# EAGLE design M633X (EAGLE 6.6.0)
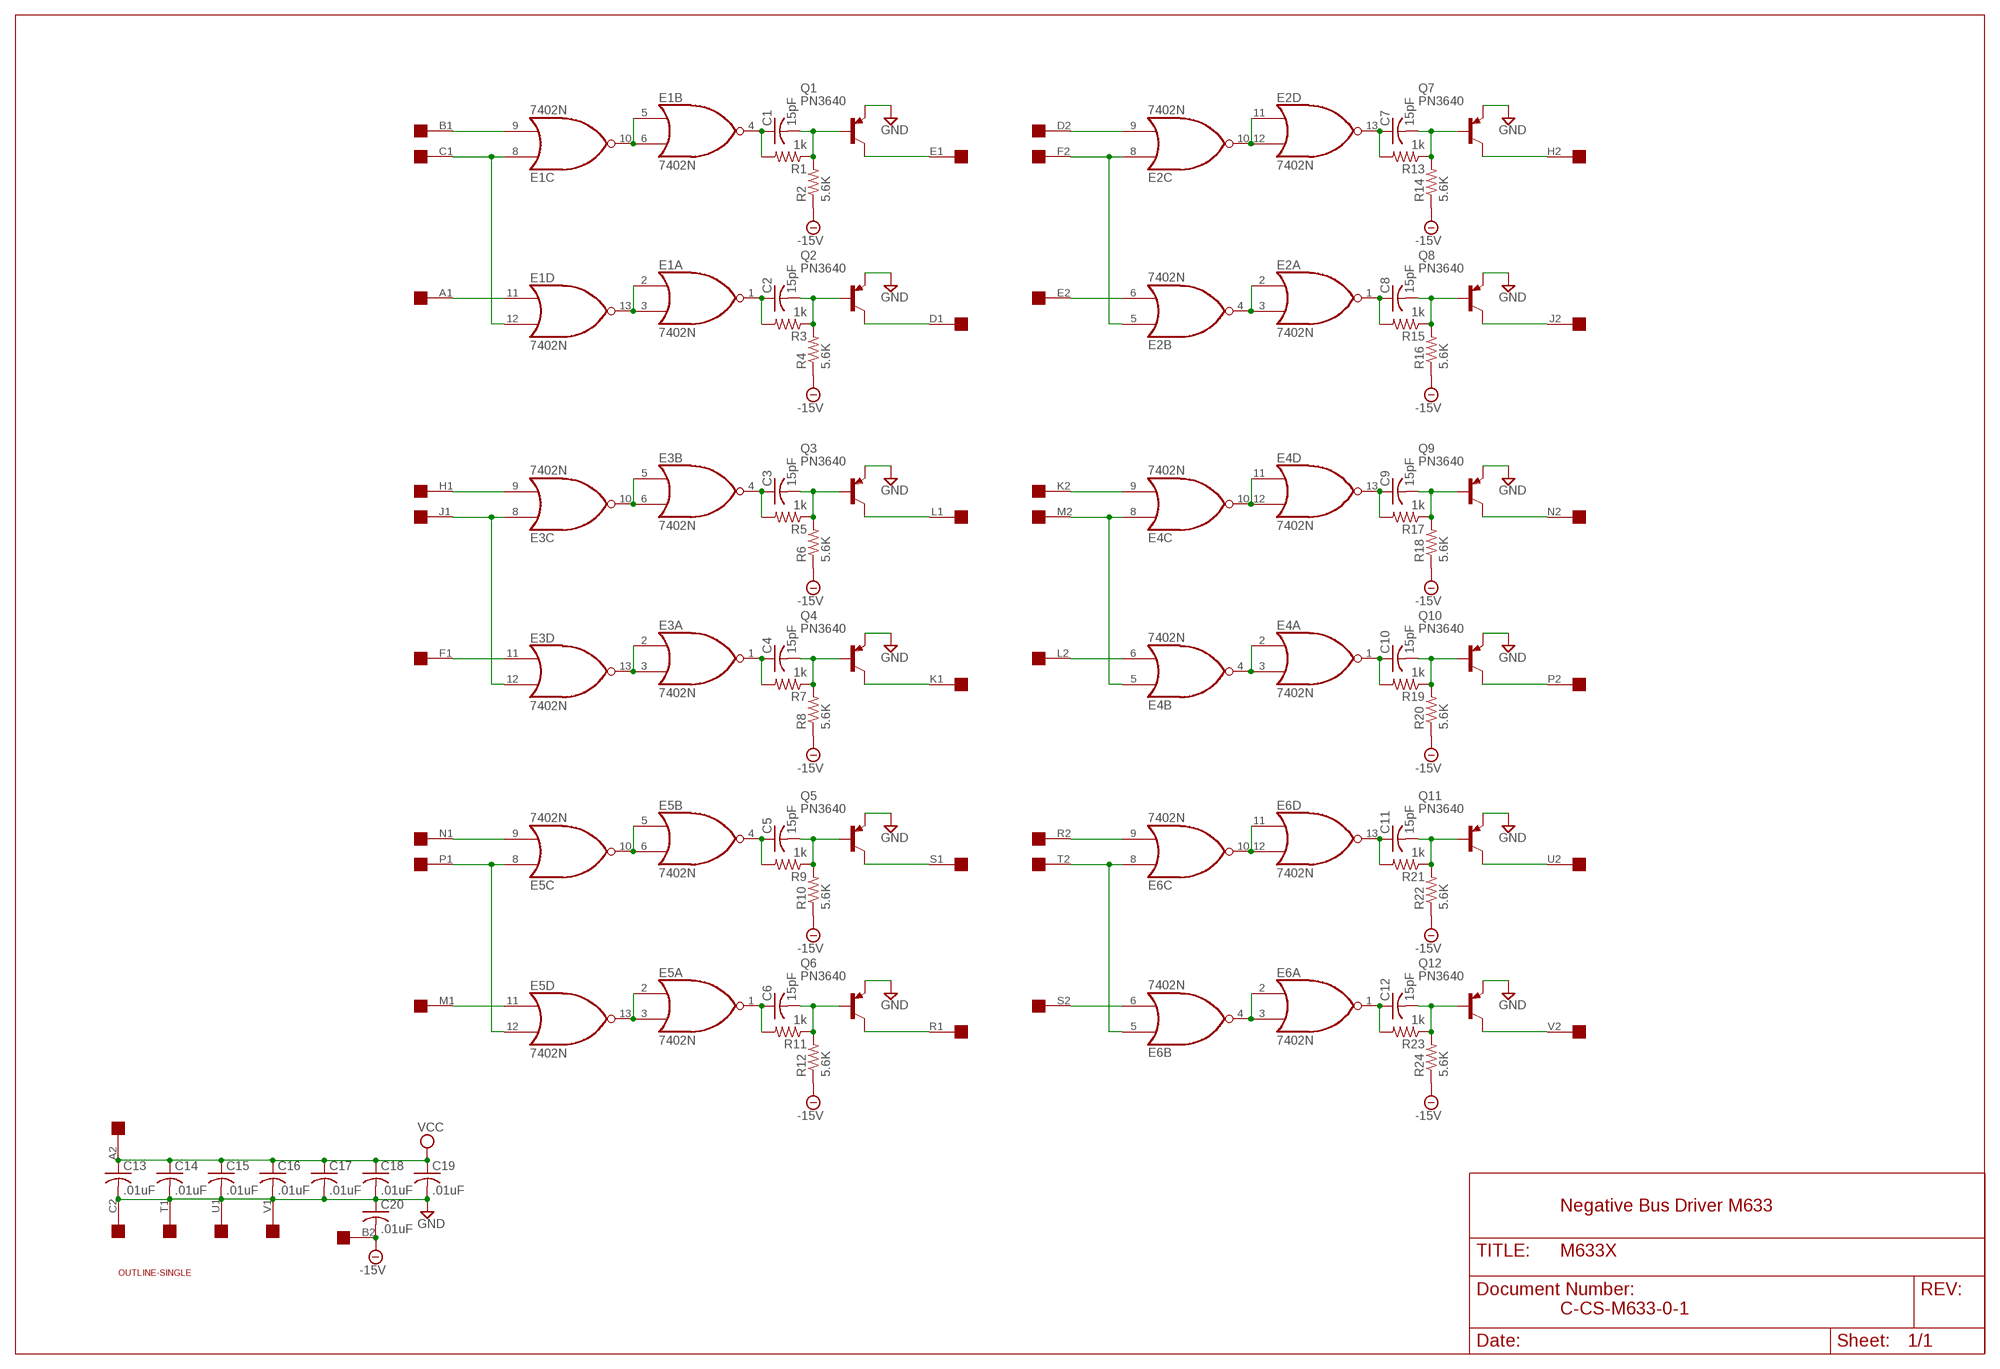
[diagram p0: schematic, sheet 1]

## Parts
C1  15pF  C-US050-025X075  [C050-025X075]
C2  15pF  C-US050-025X075  [C050-025X075]
C3  15pF  C-US050-025X075  [C050-025X075]
C4  15pF  C-US050-025X075  [C050-025X075]
C5  15pF  C-US050-025X075  [C050-025X075]
C6  15pF  C-US050-025X075  [C050-025X075]
C7  15pF  C-US050-025X075  [C050-025X075]
C8  15pF  C-US050-025X075  [C050-025X075]
C9  15pF  C-US050-025X075  [C050-025X075]
C10  15pF  C-US050-025X075  [C050-025X075]
C11  15pF  C-US050-025X075  [C050-025X075]
C12  15pF  C-US050-025X075  [C050-025X075]
C13  .01uF  C-US050-025X075  [C050-025X075]
C14  .01uF  C-US050-025X075  [C050-025X075]
C15  .01uF  C-US050-025X075  [C050-025X075]
C16  .01uF  C-US050-025X075  [C050-025X075]
C17  .01uF  C-US050-025X075  [C050-025X075]
C18  .01uF  C-US050-025X075  [C050-025X075]
C19  .01uF  C-US050-025X075  [C050-025X075]
C20  .01uF  C-US050-025X075  [C050-025X075]
E1  7402N  [DIL14]
E2  7402N  [DIL14]
E3  7402N  [DIL14]
E4  7402N  [DIL14]
E5  7402N  [DIL14]
E6  7402N  [DIL14]
Q1  PN3640  2N5415  [TO39]
Q2  PN3640  2N5415  [TO39]
Q3  PN3640  2N5415  [TO39]
Q4  PN3640  2N5415  [TO39]
Q5  PN3640  2N5415  [TO39]
Q6  PN3640  2N5415  [TO39]
Q7  PN3640  2N5415  [TO39]
Q8  PN3640  2N5415  [TO39]
Q9  PN3640  2N5415  [TO39]
Q10  PN3640  2N5415  [TO39]
Q11  PN3640  2N5415  [TO39]
Q12  PN3640  2N5415  [TO39]
R1  1k  R-US_0207/10  [0207/10]
R2  5.6K  R-US_0207/10  [0207/10]
R3  1k  R-US_0207/10  [0207/10]
R4  5.6K  R-US_0207/10  [0207/10]
R5  1k  R-US_0207/10  [0207/10]
R6  5.6K  R-US_0207/10  [0207/10]
R7  1k  R-US_0207/10  [0207/10]
R8  5.6K  R-US_0207/10  [0207/10]
R9  1k  R-US_0207/10  [0207/10]
R10  5.6K  R-US_0207/10  [0207/10]
R11  1k  R-US_0207/10  [0207/10]
R12  5.6K  R-US_0207/10  [0207/10]
R13  1k  R-US_0207/10  [0207/10]
R14  5.6K  R-US_0207/10  [0207/10]
R15  1k  R-US_0207/10  [0207/10]
R16  5.6K  R-US_0207/10  [0207/10]
R17  1k  R-US_0207/10  [0207/10]
R18  5.6K  R-US_0207/10  [0207/10]
R19  1k  R-US_0207/10  [0207/10]
R20  5.6K  R-US_0207/10  [0207/10]
R21  1k  R-US_0207/10  [0207/10]
R22  5.6K  R-US_0207/10  [0207/10]
R23  1k  R-US_0207/10  [0207/10]
R24  5.6K  R-US_0207/10  [0207/10]
U$1  OUTLINE-SINGLE  [SINGLE]
U$4  SINGLE  [EDGE-CON2]

## Nets
-15V: C20.2 R2.1 R4.1 R6.1 R8.1 R10.1 R12.1 R14.1 R16.1 R18.1 R20.1 R22.1 R24.1 U$4.B2
GND [Supply]: C13.2 C14.2 C15.2 C16.2 C17.2 C18.2 C19.2 C20.1 Q1.1(E) Q2.1(E) Q3.1(E) Q4.1(E) Q5.1(E) Q6.1(E) Q7.1(E) Q8.1(E) Q9.1(E) Q10.1(E) Q11.1(E) Q12.1(E) U$4.C2 U$4.T1 U$4.U1 U$4.V1
N$1: E1.5(B:I0) E1.6(B:I1) E1.10(C:O)
N$2: C1.1 E1.4(B:O) R1.2
N$3: C1.2 Q1.2(B) R1.1 R2.2
N$4: E1.2(A:I0) E1.3(A:I1) E1.13(D:O)
N$5: E4.10(C:O) E4.11(D:I0) E4.12(D:I1)
N$6: C9.1 E4.13(D:O) R17.2
N$7: E4.2(A:I0) E4.3(A:I1) E4.4(B:O)
N$8: C10.1 E4.1(A:O) R19.2
N$9: C10.2 Q10.2(B) R19.1 R20.2
N$10: E4.5(B:I0) E4.8(C:I0) U$4.M2
N$11: E4.9(C:I1) U$4.K2
N$12: C2.1 E1.1(A:O) R3.2
N$13: C2.2 Q2.2(B) R3.1 R4.2
N$14: E1.8(C:I0) E1.12(D:I1) U$4.C1
N$15: E1.9(C:I1) U$4.B1
N$16: E1.11(D:I0) U$4.A1
N$17: Q2.3(C) U$4.D1
N$18: Q1.3(C) U$4.E1
N$19: E2.10(C:O) E2.11(D:I0) E2.12(D:I1)
N$20: C7.1 E2.13(D:O) R13.2
N$21: C7.2 Q7.2(B) R13.1 R14.2
N$22: E2.2(A:I0) E2.3(A:I1) E2.4(B:O)
N$23: E4.6(B:I1) U$4.L2
N$24: C8.1 E2.1(A:O) R15.2
N$25: C8.2 Q8.2(B) R15.1 R16.2
N$26: E2.5(B:I0) E2.8(C:I0) U$4.F2
N$27: E2.9(C:I1) U$4.D2
N$28: E2.6(B:I1) U$4.E2
N$29: Q8.3(C) U$4.J2
N$30: Q7.3(C) U$4.H2
N$31: E3.5(B:I0) E3.6(B:I1) E3.10(C:O)
N$32: C3.1 E3.4(B:O) R5.2
N$33: Q10.3(C) U$4.P2
N$34: Q9.3(C) U$4.N2
N$35: C3.2 Q3.2(B) R5.1 R6.2
N$36: C9.2 Q9.2(B) R17.1 R18.2
N$37: E3.2(A:I0) E3.3(A:I1) E3.13(D:O)
N$38: C4.1 E3.1(A:O) R7.2
N$39: C4.2 Q4.2(B) R7.1 R8.2
N$40: E3.8(C:I0) E3.12(D:I1) U$4.J1
N$41: E3.9(C:I1) U$4.H1
N$42: E3.11(D:I0) U$4.F1
N$43: Q4.3(C) U$4.K1
N$44: Q3.3(C) U$4.L1
N$45: E5.5(B:I0) E5.6(B:I1) E5.10(C:O)
N$46: C5.1 E5.4(B:O) R9.2
N$47: C5.2 Q5.2(B) R9.1 R10.2
N$48: E5.2(A:I0) E5.3(A:I1) E5.13(D:O)
N$49: C6.1 E5.1(A:O) R11.2
N$50: C6.2 Q6.2(B) R11.1 R12.2
N$51: E5.8(C:I0) E5.12(D:I1) U$4.P1
N$52: E5.9(C:I1) U$4.N1
N$53: E5.11(D:I0) U$4.M1
N$54: Q6.3(C) U$4.R1
N$55: Q5.3(C) U$4.S1
N$56: E6.10(C:O) E6.11(D:I0) E6.12(D:I1)
N$57: C11.1 E6.13(D:O) R21.2
N$58: C11.2 Q11.2(B) R21.1 R22.2
N$59: E6.2(A:I0) E6.3(A:I1) E6.4(B:O)
N$60: C12.1 E6.1(A:O) R23.2
N$61: C12.2 Q12.2(B) R23.1 R24.2
N$62: E6.5(B:I0) E6.8(C:I0) U$4.T2
N$63: E6.9(C:I1) U$4.R2
N$64: E6.6(B:I1) U$4.S2
N$65: Q12.3(C) U$4.V2
N$66: Q11.3(C) U$4.U2
VCC [Supply]: C13.1 C14.1 C15.1 C16.1 C17.1 C18.1 C19.1 U$4.A2

## Notes on the sheet
- Negative Bus Driver M633
- C-CS-M633-0-1

## Power pins joined to a net without a drawn wire
GND: E1.7(P:GND) E2.7(P:GND) E3.7(P:GND) E4.7(P:GND) E5.7(P:GND) E6.7(P:GND)
VCC: E1.14(P:VCC) E2.14(P:VCC) E3.14(P:VCC) E4.14(P:VCC) E5.14(P:VCC) E6.14(P:VCC)

## Library data of the parts
C1-C20 = rcl:C-US: CAPACITOR, American symbol
E1-E6 = 74xx-us:74*02: Quad 2-input NOR gate
Q1-Q12 = transistor-pnp:2N5415*: PNP Transistror
R1-R24 = rcl:R-US_: RESISTOR, American symbol
U$1 = dec-con:OUTLINE-*: Board outlines for DEC boards.
U$4 = dec-con:SINGLE: Single-Height DEC board

## Net classes
1 Supply: width 0.813 mm

## Board
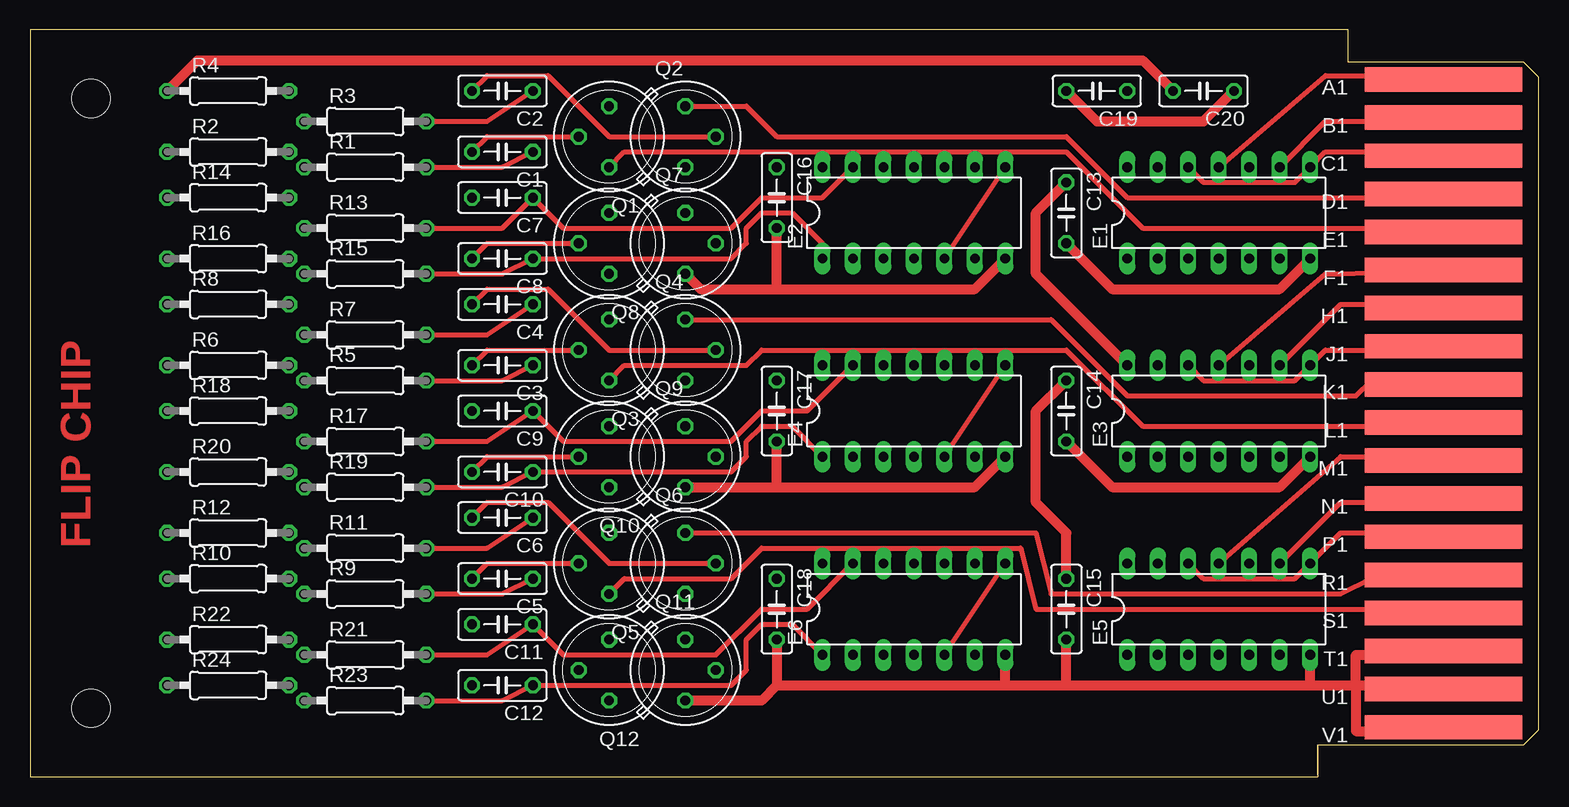
[diagram p1: board, top side]
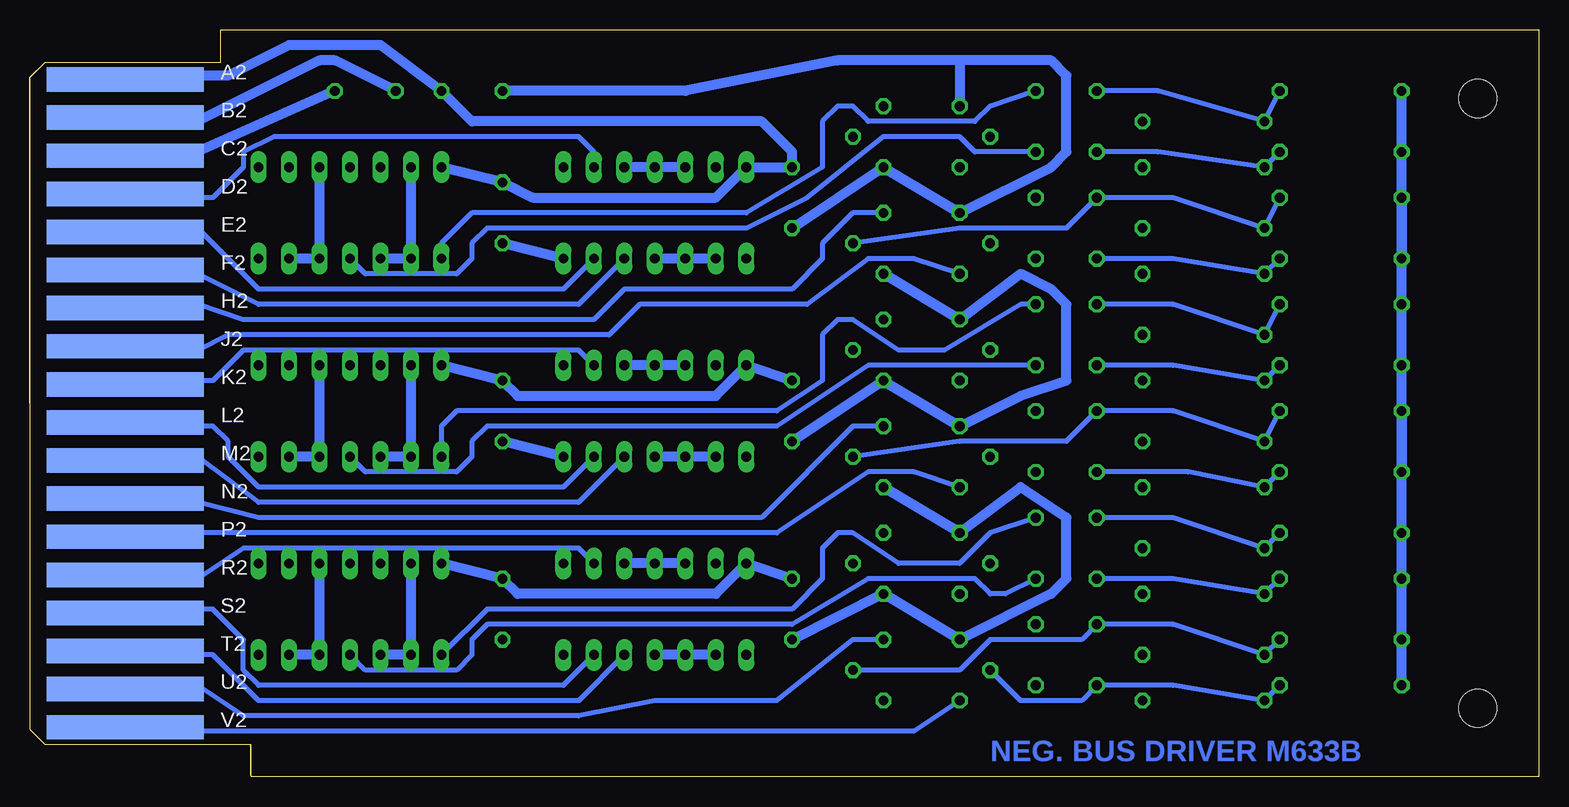
[diagram p2: board, bottom side, seen from below]

Size 125.73 x 62.23 mm. Coordinates in mm from the lower left corner, seen from the top.
Copper layers (1+16): Top 0.035mm / dielectric 1.5mm / Bottom 0.035mm
Design rules "16mils": minimum track width 16mil, minimum drill 32mil, track to track 15mil, track to pad 10mil, pad to pad 10mil, via to via 10mil, smd to smd 10mil, copper to edge 13mil, drill to drill 10mil, minimum pad ring 10mil, minimum via ring 8mil, stop-mask expansion 0mil, vias tented up to drill 0mil, thermal gap 10mil

### Footprints (pad centres in the part's own frame; a part is rotated, then mirrored left to right if it is on the bottom)
C050-025X075 = drill 0.813 octagon: 1 -2.54,0; 2 2.54,0
DIL14 = drill 0.813 long: 1 -7.62,-3.81; 2 -5.08,-3.81; 3 -2.54,-3.81; 4 0,-3.81; 5 2.54,-3.81; 6 5.08,-3.81; 7 7.62,-3.81; 8 7.62,3.81; 9 5.08,3.81; 10 2.54,3.81; 11 0,3.81; 12 -2.54,3.81; 13 -5.08,3.81; 14 -7.62,3.81
TO39 = drill 0.813 octagon: 1 0,-2.54; 2 2.54,0; 3 0,2.54
0207/10 = drill 0.813 octagon: 1 -5.08,0; 2 5.08,0
SINGLE = hole 3.175: 120.65,56.515; 120.65,5.715
EDGE-CON2 = smd 13.106 x 2.032: A1 7.938,4.128; B1 7.938,7.303; C1 7.938,10.477; D1 7.938,13.652; E1 7.938,16.828; F1 7.938,20.003; H1 7.938,23.177; J1 7.938,26.352; K1 7.938,29.527; L1 7.938,32.703; M1 7.938,35.877; N1 7.938,39.053; P1 7.938,42.227; R1 7.938,45.403; S1 7.938,48.578; T1 7.938,51.752; U1 7.938,54.928; V1 7.938,58.102 | smd 13.106 x 2.032 bottom: A2 7.938,4.128; B2 7.938,7.303; C2 7.938,10.477; D2 7.938,13.652; E2 7.938,16.828; F2 7.938,20.003; H2 7.938,23.177; J2 7.938,26.352; K2 7.938,29.527; L2 7.938,32.703; M2 7.938,35.877; N2 7.938,39.053; P2 7.938,42.227; R2 7.938,45.403; S2 7.938,48.578; T2 7.938,51.752; U2 7.938,54.928; V2 7.938,58.102

### Placement (x,y rotation side)
C1  39.37,52.07 180 top
C2  39.37,57.15 180 top
C3  39.37,34.29 180 top
C4  39.37,39.37 180 top
C5  39.37,16.51 180 top
C6  39.37,21.59 180 top
C7  39.37,48.26 180 top
C8  39.37,43.18 180 top
C9  39.37,30.48 180 top
C10  39.37,25.4 180 top
C11  39.37,12.7 180 top
C12  39.37,7.62 180 top
C13  86.36,46.99 270 top
C14  86.36,30.48 270 top
C15  86.36,13.97 270 top
C16  62.23,48.26 270 top
C17  62.23,30.48 270 top
C18  62.23,13.97 270 top
C19  88.9,57.15 180 top
C20  97.79,57.15 180 top
E1  99.06,46.99 0 top
E2  73.66,46.99 0 top
E3  99.06,30.48 0 top
E4  73.66,30.48 0 top
E5  99.06,13.97 0 top
E6  73.66,13.97 0 top
Q1  48.26,53.34 180 top
Q2  54.61,53.34 0 top
Q3  48.26,35.56 180 top
Q4  54.61,35.56 0 top
Q5  48.26,17.78 180 top
Q6  54.61,17.78 0 top
Q7  54.61,44.45 0 top
Q8  48.26,44.45 180 top
Q9  54.61,26.67 0 top
Q10  48.26,26.67 180 top
Q11  54.61,8.89 0 top
Q12  48.26,8.89 180 top
R1  27.94,50.8 0 top
R2  16.51,52.07 0 top
R3  27.94,54.61 0 top
R4  16.51,57.15 0 top
R5  27.94,33.02 0 top
R6  16.51,34.29 0 top
R7  27.94,36.83 0 top
R8  16.51,39.37 0 top
R9  27.94,15.24 0 top
R10  16.51,16.51 0 top
R11  27.94,19.05 0 top
R12  16.51,20.32 0 top
R13  27.94,45.72 0 top
R14  16.51,48.26 0 top
R15  27.94,41.91 0 top
R16  16.51,43.18 0 top
R17  27.94,27.94 0 top
R18  16.51,30.48 0 top
R19  27.94,24.13 0 top
R20  16.51,25.4 0 top
R21  27.94,10.16 0 top
R22  16.51,11.43 0 top
R23  27.94,6.35 0 top
R24  16.51,7.62 0 top
U$1  125.73,62.23 180 top
U$2  [FLIPCHIP]  0,0 0 top
U$4  125.73,62.23 180 top

### Tracks (layer width: path | path; a pad name or v marks a point on that pad's centre or on a via)
-15V
  Top 0.813: C20.2 92.71,59.69 13.97,59.69 R4.1
  Bottom 0.813: U$4.B2 116.84,54.61 111.76,54.61 101.6,59.69 100.33,59.69 C20.2 | R4.1 R2.1 R16.1 R14.1 R8.1 R6.1 R20.1 R18.1 R12.1 R10.1 R24.1 R22.1
GND
  Top 0.813: U$4.V1 116.84,3.81 110.49,3.81 110.49,7.62 | 110.49,7.62 110.49,10.16 116.84,10.16 U$4.T1 | U$4.U1 116.84,7.62 110.49,7.62 | 106.68,7.62 E5.7 | 106.68,7.62 110.49,7.62 | 81.28,7.62 E6.7 | 81.28,7.62 86.36,7.62 | 86.36,7.62 106.68,7.62 | 86.36,7.62 C15.2 | C18.2 62.23,7.62 | 62.23,7.62 81.28,7.62 | Q11.1 60.96,6.35 62.23,7.62 | E3.7 104.14,24.13 90.17,24.13 C14.2 | E1.7 104.14,40.64 90.17,40.64 C13.2 | 62.23,24.13 C17.2 | 62.23,24.13 78.74,24.13 E4.7 | Q9.1 62.23,24.13 | E2.7 78.74,40.64 62.23,40.64 | 62.23,40.64 55.88,40.64 Q7.1 | 62.23,40.64 C16.2 | C20.1 97.79,54.61 88.9,54.61 C19.2
  Bottom 0.813: U$4.C2 116.84,52.07 111.76,52.07 C20.1 | 48.26,59.69 Q1.1 | 48.26,59.69 58.42,59.69 71.12,57.15 C19.2 | 48.26,59.69 40.64,59.69 39.37,58.42 39.37,52.07 40.64,50.8 Q8.1 Q2.1 C16.2 | E2.7 C13.2 | E4.7 C14.2 | C18.2 Q6.1 Q12.1 40.64,15.24 39.37,16.51 39.37,21.59 43.18,24.13 Q5.1 Q9.1 | C17.2 Q4.1 Q10.1 43.18,31.75 39.37,33.02 39.37,39.37 40.64,40.64 43.18,41.91 Q3.1 Q7.1
N$1
  Bottom 0.813: E1.10 E1.5 E1.6
N$2
  Top 0.406: R1.2 39.37,50.8 C1.1
  Bottom 0.406: C1.1 46.99,52.07 48.26,53.34 54.61,53.34 60.96,48.26 66.04,45.72 87.63,45.72 88.9,44.45 88.9,43.18 90.17,41.91 97.79,41.91 E1.4
N$3
  Top 0.406: C1.2 38.1,53.34 Q1.2
  Bottom 0.406: R2.2 R1.1 31.75,52.07 C1.2
N$4
  Bottom 0.813: E1.3 E1.2 E1.13
N$5
  Bottom 0.813: E4.12 E4.11 E4.10
N$6
  Top 0.406: R17.2 38.1,27.94 C9.1 44.45,27.94 58.42,27.94 60.96,30.48 64.77,30.48 E4.13
N$7
  Bottom 0.813: E4.2 E4.3 E4.4
N$8
  Top 0.406: R19.2 39.37,24.13 C10.1 58.42,25.4 59.69,26.67 59.69,27.94 60.96,29.21 63.5,29.21 E4.1
N$9
  Top 0.406: C10.2 38.1,26.67 Q10.2
  Bottom 0.406: R20.2 R19.1 29.21,25.4 C10.2
N$10
  Top 0.406: E4.5 E4.8
  Bottom 0.406: U$4.M2 116.84,26.67 111.76,26.67 106.68,22.86 80.01,22.86 E4.5
N$11
  Bottom 0.406: U$4.K2 115.57,33.02 110.49,33.02 107.95,35.56 80.01,35.56 E4.9
N$12
  Top 0.406: R3.2 38.1,54.61 C2.1
  Bottom 0.406: C2.1 45.72,55.88 46.99,54.61 55.88,54.61 57.15,55.88 58.42,55.88 59.69,54.61 59.69,50.8 66.04,46.99 88.9,46.99 91.44,44.45 E1.1
N$13
  Top 0.406: C2.2 38.1,58.42 43.18,58.42 48.26,53.34 Q2.2
  Bottom 0.406: C2.2 31.75,57.15 R3.1 R4.2
N$14
  Top 0.406: U$4.C1 116.84,52.07 107.95,52.07 E1.8 105.41,49.53 97.79,49.53 E1.12
N$15
  Top 0.406: U$4.B1 116.84,54.61 107.95,54.61 E1.9
N$16
  Top 0.406: U$4.A1 116.84,58.42 107.95,58.42 E1.11
N$17
  Top 0.406: U$4.D1 116.84,48.26 91.44,48.26 86.36,53.34 62.23,53.34 59.69,55.88 Q2.3
N$18
  Top 0.406: U$4.E1 116.84,45.72 92.71,45.72 86.36,52.07 49.53,52.07 Q1.3
N$19
  Bottom 0.813: E2.12 E2.11 E2.10
N$20
  Top 0.406: R13.2 39.37,45.72 C7.1 44.45,45.72 58.42,45.72 60.96,48.26 66.04,48.26 E2.13
N$21
  Bottom 0.406: R14.2 R13.1 30.48,48.26 C7.2 39.37,45.72 48.26,45.72 Q7.2
N$22
  Bottom 0.813: E2.2 E2.3 E2.4
N$23
  Bottom 0.406: U$4.L2 116.84,29.21 110.49,29.21 109.22,27.94 109.22,26.67 106.68,24.13 81.28,24.13 E4.6
N$24
  Top 0.406: R15.2 39.37,41.91 C8.1 58.42,43.18 59.69,44.45 59.69,45.72 60.96,46.99 63.5,46.99 66.04,44.45 E2.1
N$25
  Top 0.406: C8.2 38.1,44.45 Q8.2
  Bottom 0.406: R16.2 R15.1 30.48,43.18 C8.2
N$26
  Top 0.406: E2.5 E2.8
  Bottom 0.406: U$4.F2 115.57,41.91 111.76,41.91 106.68,39.37 80.01,39.37 E2.5
N$27
  Bottom 0.406: E2.9 78.74,52.07 80.01,53.34 105.41,53.34 107.95,52.07 107.95,50.8 110.49,48.26 116.84,48.26 U$4.D2
N$28
  Bottom 0.406: U$4.E2 116.84,45.72 111.76,45.72 106.68,40.64 81.28,40.64 E2.6
N$29
  Bottom 0.406: U$4.J2 116.84,35.56 111.76,35.56 109.22,36.83 77.47,36.83 74.93,39.37 60.96,39.37 55.88,43.18 52.07,43.18 Q8.3
N$30
  Bottom 0.406: U$4.H2 116.84,39.37 111.76,39.37 107.95,38.1 78.74,38.1 76.2,40.64 62.23,40.64 59.69,43.18 59.69,44.45 57.15,46.99 Q7.3
N$31
  Bottom 0.813: E3.6 E3.5 E3.10
N$32
  Top 0.406: R5.2 39.37,33.02 C3.1
  Bottom 0.406: E3.4 97.79,25.4 90.17,25.4 88.9,26.67 88.9,27.94 87.63,29.21 63.5,29.21 55.88,34.29 C3.1
N$33
  Bottom 0.406: U$4.P2 116.84,20.32 63.5,20.32 55.88,25.4 52.07,25.4 Q10.3
N$34
  Bottom 0.406: U$4.N2 116.84,22.86 111.76,22.86 106.68,21.59 64.77,21.59 57.15,29.21 Q9.3
N$35
  Top 0.406: C3.2 38.1,35.56 Q3.2
  Bottom 0.406: R6.2 R5.1 30.48,34.29 C3.2
N$36
  Bottom 0.406: R18.2 R17.1 30.48,30.48 C9.2 39.37,27.94 48.26,27.94 Q9.2
N$37
  Bottom 0.813: E3.3 E3.2 E3.13
N$38
  Top 0.406: R7.2 38.1,36.83 C4.1
  Bottom 0.406: E3.1 91.44,29.21 90.17,30.48 63.5,30.48 59.69,33.02 59.69,36.83 58.42,38.1 57.15,38.1 53.34,35.56 49.53,35.56 43.18,39.37 C4.1
N$39
  Top 0.406: Q4.2 48.26,35.56 43.18,40.64 38.1,40.64 C4.2
  Bottom 0.406: C4.2 30.48,39.37 R7.1 R8.2
N$40
  Top 0.406: U$4.J1 116.84,35.56 107.95,35.56 E3.8 105.41,33.02 97.79,33.02 E3.12
N$41
  Top 0.406: U$4.H1 116.84,39.37 109.22,39.37 E3.9
N$42
  Top 0.406: U$4.F1 109.22,41.91 107.95,41.91 E3.11
N$43
  Top 0.406: U$4.K1 116.84,33.02 111.76,33.02 110.49,31.75 91.44,31.75 85.09,38.1 Q4.3
N$44
  Top 0.406: U$4.L1 116.84,29.21 92.71,29.21 86.36,35.56 60.96,35.56 59.69,34.29 49.53,34.29 Q3.3
N$45
  Bottom 0.813: E5.6 E5.5 E5.10
N$46
  Top 0.406: R9.2 39.37,15.24 C5.1
  Bottom 0.406: E5.4 97.79,8.89 90.17,8.89 88.9,10.16 88.9,11.43 87.63,12.7 62.23,12.7 55.88,16.51 46.99,16.51 45.72,15.24 44.45,15.24 C5.1
N$47
  Top 0.406: C5.2 38.1,17.78 Q5.2
  Bottom 0.406: R10.2 R9.1 30.48,16.51 C5.2
N$48
  Bottom 0.813: E5.3 E5.2 E5.13
N$49
  Top 0.406: R11.2 38.1,19.05 C6.1
  Bottom 0.406: E5.1 87.63,13.97 62.23,13.97 59.69,16.51 59.69,19.05 58.42,20.32 57.15,20.32 53.34,17.78 48.26,17.78 45.72,20.32 C6.1
N$50
  Top 0.406: C6.2 38.1,22.86 43.18,22.86 48.26,17.78 Q6.2
  Bottom 0.406: R12.2 R11.1 30.48,21.59 C6.2
N$51
  Top 0.406: U$4.P1 116.84,20.32 109.22,20.32 E5.8 105.41,16.51 97.79,16.51 E5.12
N$52
  Top 0.406: U$4.N1 116.84,22.86 109.22,22.86 E5.9
N$53
  Top 0.406: U$4.M1 116.84,26.67 109.22,26.67 E5.11
N$54
  Top 0.406: U$4.R1 116.84,16.51 111.76,16.51 109.22,15.24 85.09,15.24 83.82,20.32 Q6.3
N$55
  Top 0.406: U$4.S1 116.84,13.97 83.82,13.97 82.55,19.05 60.96,19.05 58.42,16.51 49.53,16.51 Q5.3
N$56
  Bottom 0.813: E6.12 E6.11 E6.10
N$57
  Top 0.406: R21.2 38.1,10.16 C11.1 44.45,10.16 57.15,10.16 60.96,13.97 64.77,13.97 E6.13
N$58
  Bottom 0.406: R22.2 R21.1 30.48,12.7 C11.2 38.1,11.43 45.72,11.43 48.26,8.89 Q11.2
N$59
  Bottom 0.813: E6.2 E6.3 E6.4
N$60
  Top 0.406: R23.2 39.37,6.35 C12.1 58.42,7.62 59.69,8.89 59.69,11.43 60.96,12.7 63.5,12.7 E6.1
N$61
  Bottom 0.406: R24.2 R23.1 30.48,7.62 C12.2 38.1,6.35 43.18,6.35 Q12.2
N$62
  Top 0.406: E6.5 E6.8
  Bottom 0.406: U$4.T2 116.84,10.16 110.49,10.16 106.68,6.35 80.01,6.35 E6.5
N$63
  Bottom 0.406: U$4.R2 115.57,16.51 111.76,16.51 107.95,19.05 80.01,19.05 E6.9
N$64
  Bottom 0.406: U$4.S2 116.84,13.97 110.49,13.97 107.95,11.43 107.95,8.89 106.68,7.62 81.28,7.62 E6.6
N$65
  Bottom 0.406: U$4.V2 116.84,3.81 52.07,3.81 Q12.3
N$66
  Bottom 0.406: U$4.U2 116.84,7.62 111.76,7.62 107.95,5.08 80.01,5.08 73.66,6.35 63.5,6.35 57.15,11.43 Q11.3
VCC
  Top 0.813: E3.14 83.82,41.91 83.82,46.99 C13.1 | C15.1 86.36,20.32 83.82,22.86 83.82,30.48 C14.1
  Bottom 0.813: U$4.A2 117.24,58.02 116.84,58.42 109.22,58.42 104.14,60.96 96.52,60.96 C19.1 88.9,54.61 64.77,54.61 62.23,52.07 C16.1 E2.14 68.58,48.26 83.82,48.26 C13.1 E1.14 | E3.14 C14.1 85.09,31.75 68.58,31.75 E4.14 C17.1 | E5.14 C15.1 85.09,15.24 68.58,15.24 E6.14 C18.1

### Text on the board
Bottom: NEG. BUS DRIVER M633B